# Altium schematic sheet mcu-emif-etm-dmm.SchDoc
size A3; DocumentNumber: 25; SheetNumber: 25; SheetTotal: 45; SheetDescription: MCU EMIF, ETM and DMM
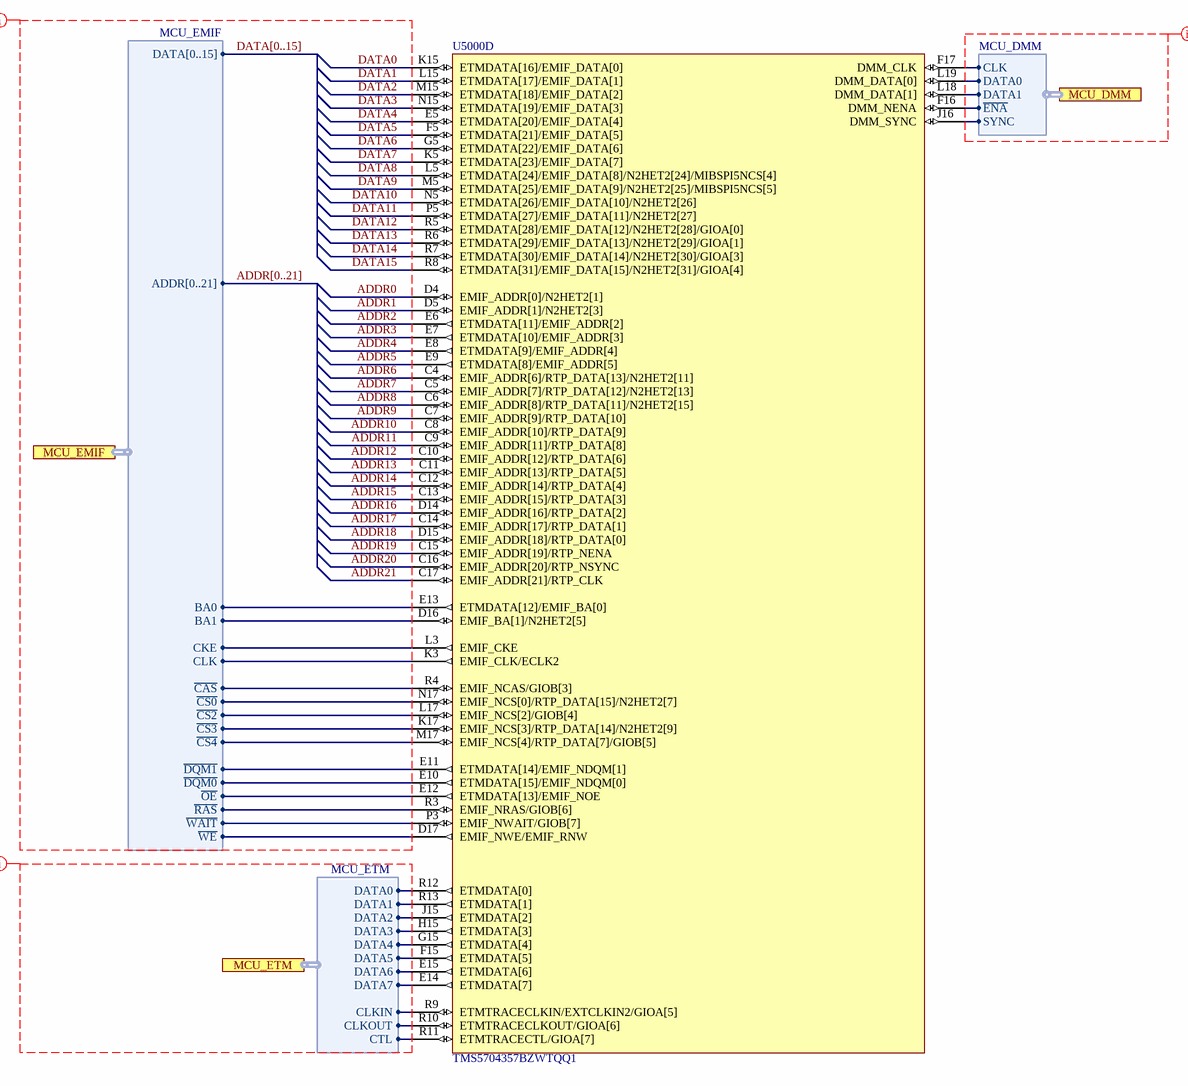
[diagram p0: mcu-emif-etm-dmm.SchDoc]

## Parts
U5000  TMS5704357BZWTQQ1  [BGA337C80P19X19_1600X1600X140]  (part D of 6)

## Ports
MCU_DMM (harness MCU_DMM), MCU_EMIF (harness MCU_EMIF), MCU_ETM (harness MCU_ETM)

## Harnesses
MCU_ETM: CLKOUT, CTL, CLKIN, DATA0, DATA1, DATA2, DATA3, DATA4, DATA5, DATA6, DATA7
MCU_DMM: CLK, DATA0, DATA1, SYNC, ~{ENA}
MCU_EMIF: DATA[0..15], ADDR[0..21], BA0, BA1, CKE, CLK, ~{CAS}, ~{CS0}, ~{CS2}, ~{CS3}, ~{CS4}, ~{DQM1}, ~{DQM0}, ~{OE}, ~{RAS}, ~{WAIT}, ~{WE}

## Nets
ADDR0: U5000.D4(EMIF_ADDR[0]/N2HET2[1])
ADDR1: U5000.D5(EMIF_ADDR[1]/N2HET2[3])
ADDR2: U5000.E6(ETMDATA[11]/EMIF_ADDR[2])
ADDR3: U5000.E7(ETMDATA[10]/EMIF_ADDR[3])
ADDR4: U5000.E8(ETMDATA[9]/EMIF_ADDR[4])
ADDR5: U5000.E9(ETMDATA[8]/EMIF_ADDR[5])
ADDR6: U5000.C4(EMIF_ADDR[6]/RTP_DATA[13]/N2HET2[11])
ADDR7: U5000.C5(EMIF_ADDR[7]/RTP_DATA[12]/N2HET2[13])
ADDR8: U5000.C6(EMIF_ADDR[8]/RTP_DATA[11]/N2HET2[15])
ADDR9: U5000.C7(EMIF_ADDR[9]/RTP_DATA[10])
ADDR10: U5000.C8(EMIF_ADDR[10]/RTP_DATA[9])
ADDR11: U5000.C9(EMIF_ADDR[11]/RTP_DATA[8])
ADDR12: U5000.C10(EMIF_ADDR[12]/RTP_DATA[6])
ADDR13: U5000.C11(EMIF_ADDR[13]/RTP_DATA[5])
ADDR14: U5000.C12(EMIF_ADDR[14]/RTP_DATA[4])
ADDR15: U5000.C13(EMIF_ADDR[15]/RTP_DATA[3])
ADDR16: U5000.D14(EMIF_ADDR[16]/RTP_DATA[2])
ADDR17: U5000.C14(EMIF_ADDR[17]/RTP_DATA[1])
ADDR18: U5000.D15(EMIF_ADDR[18]/RTP_DATA[0])
ADDR19: U5000.C15(EMIF_ADDR[19]/RTP_NENA)
ADDR20: U5000.C16(EMIF_ADDR[20]/RTP_NSYNC)
ADDR21: U5000.C17(EMIF_ADDR[21]/RTP_CLK)
DATA0: U5000.K15(ETMDATA[16]/EMIF_DATA[0])
DATA1: U5000.L15(ETMDATA[17]/EMIF_DATA[1])
DATA2: U5000.M15(ETMDATA[18]/EMIF_DATA[2])
DATA3: U5000.N15(ETMDATA[19]/EMIF_DATA[3])
DATA4: U5000.E5(ETMDATA[20]/EMIF_DATA[4])
DATA5: U5000.F5(ETMDATA[21]/EMIF_DATA[5])
DATA6: U5000.G5(ETMDATA[22]/EMIF_DATA[6])
DATA7: U5000.K5(ETMDATA[23]/EMIF_DATA[7])
DATA8: U5000.L5(ETMDATA[24]/EMIF_DATA[8]/N2HET2[24]/MIBSPI5NCS[4])
DATA9: U5000.M5(ETMDATA[25]/EMIF_DATA[9]/N2HET2[25]/MIBSPI5NCS[5])
DATA10: U5000.N5(ETMDATA[26]/EMIF_DATA[10]/N2HET2[26])
DATA11: U5000.P5(ETMDATA[27]/EMIF_DATA[11]/N2HET2[27])
DATA12: U5000.R5(ETMDATA[28]/EMIF_DATA[12]/N2HET2[28]/GIOA[0])
DATA13: U5000.R6(ETMDATA[29]/EMIF_DATA[13]/N2HET2[29]/GIOA[1])
DATA14: U5000.R7(ETMDATA[30]/EMIF_DATA[14]/N2HET2[30]/GIOA[3])
DATA15: U5000.R8(ETMDATA[31]/EMIF_DATA[15]/N2HET2[31]/GIOA[4])
NetU5000_D16: U5000.D16(EMIF_BA[1]/N2HET2[5]) ; port MCU_EMIF.BA1
NetU5000_D17: U5000.D17(EMIF_NWE/EMIF_RNW) ; port MCU_EMIF.~{WE}
NetU5000_E10: U5000.E10(ETMDATA[15]/EMIF_NDQM[0]) ; port MCU_EMIF.~{DQM0}
NetU5000_E11: U5000.E11(ETMDATA[14]/EMIF_NDQM[1]) ; port MCU_EMIF.~{DQM1}
NetU5000_E12: U5000.E12(ETMDATA[13]/EMIF_NOE) ; port MCU_EMIF.~{OE}
NetU5000_E13: U5000.E13(ETMDATA[12]/EMIF_BA[0]) ; port MCU_EMIF.BA0
NetU5000_E14: U5000.E14(ETMDATA[7]) ; port MCU_ETM.DATA7
NetU5000_E15: U5000.E15(ETMDATA[6]) ; port MCU_ETM.DATA6
NetU5000_F15: U5000.F15(ETMDATA[5]) ; port MCU_ETM.DATA5
NetU5000_F16: U5000.F16(DMM_NENA) ; port MCU_DMM.~{ENA}
NetU5000_F17: U5000.F17(DMM_CLK) ; port MCU_DMM.CLK
NetU5000_G15: U5000.G15(ETMDATA[4]) ; port MCU_ETM.DATA4
NetU5000_H15: U5000.H15(ETMDATA[3]) ; port MCU_ETM.DATA3
NetU5000_J15: U5000.J15(ETMDATA[2]) ; port MCU_ETM.DATA2
NetU5000_J16: U5000.J16(DMM_SYNC) ; port MCU_DMM.SYNC
NetU5000_K3: U5000.K3(EMIF_CLK/ECLK2) ; port MCU_EMIF.CLK
NetU5000_K17: U5000.K17(EMIF_NCS[3]/RTP_DATA[14]/N2HET2[9]) ; port MCU_EMIF.~{CS3}
NetU5000_L3: U5000.L3(EMIF_CKE) ; port MCU_EMIF.CKE
NetU5000_L17: U5000.L17(EMIF_NCS[2]/GIOB[4]) ; port MCU_EMIF.~{CS2}
NetU5000_L18: U5000.L18(DMM_DATA[1]) ; port MCU_DMM.DATA1
NetU5000_L19: U5000.L19(DMM_DATA[0]) ; port MCU_DMM.DATA0
NetU5000_M17: U5000.M17(EMIF_NCS[4]/RTP_DATA[7]/GIOB[5]) ; port MCU_EMIF.~{CS4}
NetU5000_N17: U5000.N17(EMIF_NCS[0]/RTP_DATA[15]/N2HET2[7]) ; port MCU_EMIF.~{CS0}
NetU5000_P3: U5000.P3(EMIF_NWAIT/GIOB[7]) ; port MCU_EMIF.~{WAIT}
NetU5000_R3: U5000.R3(EMIF_NRAS/GIOB[6]) ; port MCU_EMIF.~{RAS}
NetU5000_R4: U5000.R4(EMIF_NCAS/GIOB[3]) ; port MCU_EMIF.~{CAS}
NetU5000_R9: U5000.R9(ETMTRACECLKIN/EXTCLKIN2/GIOA[5]) ; port MCU_ETM.CLKIN
NetU5000_R10: U5000.R10(ETMTRACECLKOUT/GIOA[6]) ; port MCU_ETM.CLKOUT
NetU5000_R11: U5000.R11(ETMTRACECTL/GIOA[7]) ; port MCU_ETM.CTL
NetU5000_R12: U5000.R12(ETMDATA[0]) ; port MCU_ETM.DATA0
NetU5000_R13: U5000.R13(ETMDATA[1]) ; port MCU_ETM.DATA1

## Buses and harness runs
bus ADDR[0..21]
bus DATA[0..15]

## Layout directives
net class MCU_EMIF: ADDR0, ADDR1, ADDR2, ADDR3, ADDR4, ADDR5, ADDR6, ADDR7, ADDR8, ADDR9, ADDR10, ADDR11, ADDR12, ADDR13, ADDR14, ADDR15, ADDR16, ADDR17, ADDR18, ADDR19, ADDR20, ADDR21, ADDR[0..21], DATA0, DATA1, DATA2, DATA3, DATA4, DATA5, DATA6, DATA7, DATA8, DATA9, DATA10, DATA11, DATA12, DATA13, DATA14, DATA15, DATA[0..15]
net class MCU_ETM: (no net found under the mark)
net class MCU_DMM: (no net found under the mark)

## Notes on the sheet
- Fraunhofer IISB
- Schottkystr. 10
- developed by:
- 91058 Erlangen
- Germany
- Author
- Project
- License
- Description
- File
- Version
- Release Date
- Sheet
- foxbms.org <https://foxbms.org>
- www.iisb.fraunhofer.de <https://www.iisb.fraunhofer.de/>
- foxBMS Team
- /